# Altium schematic sheet MSP430F249.SCHDOC
size A4; Organization: UNSW Solar Racing Team; Address3: UNSW; Address4: Sydney NSW 2052; Address2: Electrical Engineering; Address1: Rm 109
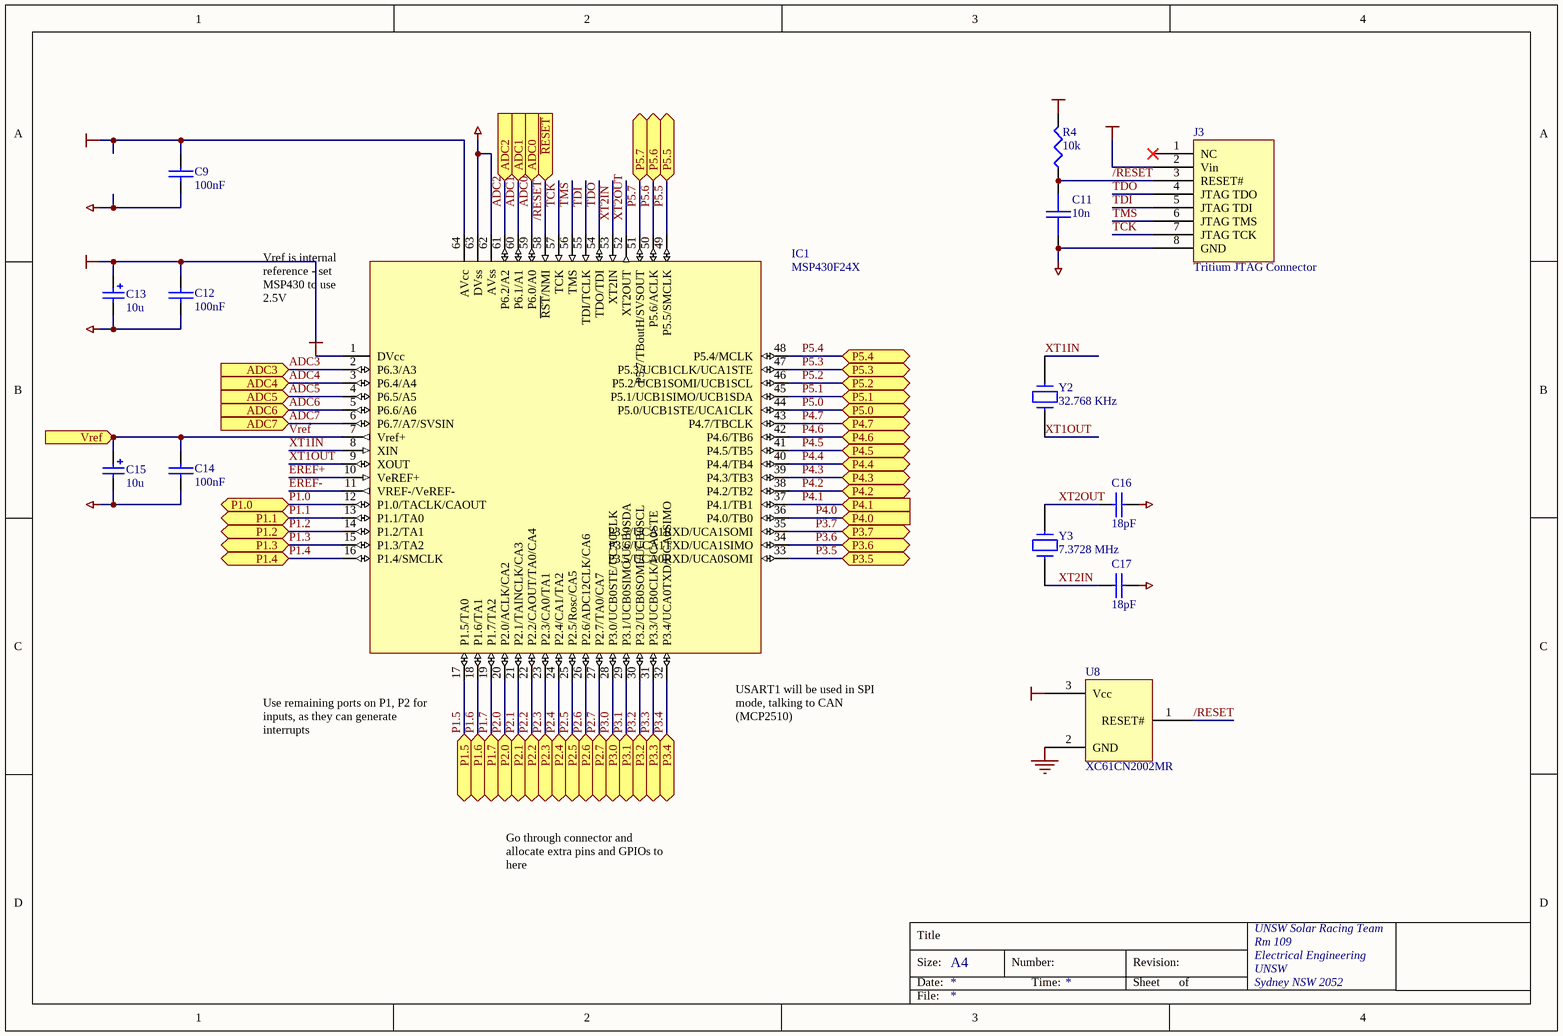
[diagram p0: MSP430F249.SCHDOC]

## Parts
C9  100nF  [0603]
C11  10n  [0603]
C12  100nF  [0603]
C13  10u  [0805]
C14  100nF  [0603]
C15  10u  [0805]
C16  18pF  [0603]
C17  18pF  [0603]
IC1  MSP430F24X  [QFP64]
J3  Tritium JTAG Connector  [IDC10]
R4  10k  [0603]
U8  XC61CN2002MR  [SOT23(3)]
Y2  32.768 KHz  [WATCHA]
Y3  7.3728 MHz  [HC49/4H]

## Ports
ADC0 (in), ADC1 (in), ADC2 (in), ADC3 (in), ADC4 (in), ADC5 (in), ADC6 (in), ADC7 (in), P1.0, P1.1, P1.2, P1.3, P1.4, P1.5, P1.6, P1.7, P2.0, P2.1, P2.2, P2.3, P2.4, P2.5, P2.6, P2.7, P3.0, P3.1, P3.2, P3.3, P3.4, P3.5, P3.6, P3.7, P4.0 (in), P4.1 (in), P4.2, P4.3, P4.4, P4.5, P4.6, P4.7, P5.0, P5.1, P5.2, P5.3, P5.4, P5.5, P5.6, P5.7, Vref (out), ~{RESET} (in)

## Nets
3V3: C9.1 C12.1 C13.1 IC1.1(DVcc) IC1.64(AVcc) J3.2(Vin) R4.2 U8.3(Vcc)
GND: C9.2 C11.2 C12.2 C13.2 C14.2 C15.2 C16.2 C17.2 IC1.62(AVss) IC1.63(DVss) J3.8(GND) U8.2(GND)
/RESET: C11.1 IC1.58(~{RST}/NMI) J3.3(RESET#) R4.1 U8.1(RESET#) ; port ~{RESET}
ADC0: IC1.59(P6.0/A0) ; port ADC0
ADC1: IC1.60(P6.1/A1) ; port ADC1
ADC2: IC1.61(P6.2/A2) ; port ADC2
ADC3: IC1.2(P6.3/A3) ; port ADC3
ADC4: IC1.3(P6.4/A4) ; port ADC4
ADC5: IC1.4(P6.5/A5) ; port ADC5
ADC6: IC1.5(P6.6/A6) ; port ADC6
ADC7: IC1.6(P6.7/A7/SVSIN) ; port ADC7
EREF+: IC1.10(VeREF+)
EREF-: IC1.11(VREF-/VeREF-)
P1.0: IC1.12(P1.0/TACLK/CAOUT) ; port P1.0
P1.1: IC1.13(P1.1/TA0) ; port P1.1
P1.2: IC1.14(P1.2/TA1) ; port P1.2
P1.3: IC1.15(P1.3/TA2) ; port P1.3
P1.4: IC1.16(P1.4/SMCLK) ; port P1.4
P1.5: IC1.17(P1.5/TA0) ; port P1.5
P1.6: IC1.18(P1.6/TA1) ; port P1.6
P1.7: IC1.19(P1.7/TA2) ; port P1.7
P2.0: IC1.20(P2.0/ACLK/CA2) ; port P2.0
P2.1: IC1.21(P2.1/TAINCLK/CA3) ; port P2.1
P2.2: IC1.22(P2.2/CAOUT/TA0/CA4) ; port P2.2
P2.3: IC1.23(P2.3/CA0/TA1) ; port P2.3
P2.4: IC1.24(P2.4/CA1/TA2) ; port P2.4
P2.5: IC1.25(P2.5/Rosc/CA5) ; port P2.5
P2.6: IC1.26(P2.6/ADC12CLK/CA6) ; port P2.6
P2.7: IC1.27(P2.7/TA0/CA7) ; port P2.7
P3.0: IC1.28(P3.0/UCB0STE/UCA0CLK) ; port P3.0
P3.1: IC1.29(P3.1/UCB0SIMO/UCB0SDA) ; port P3.1
P3.2: IC1.30(P3.2/UCB0SOMI/UCB0SCL) ; port P3.2
P3.3: IC1.31(P3.3/UCB0CLK/UCA0STE) ; port P3.3
P3.4: IC1.32(P3.4/UCA0TXD/UCA0SIMO) ; port P3.4
P3.5: IC1.33(P3.5/UCA0RXD/UCA0SOMI) ; port P3.5
P3.6: IC1.34(P3.6/UCA1TXD/UCA1SIMO) ; port P3.6
P3.7: IC1.35(P3.7/UCA1RXD/UCA1SOMI) ; port P3.7
P4.0: IC1.36(P4.0/TB0) ; port P4.0
P4.1: IC1.37(P4.1/TB1) ; port P4.1
P4.2: IC1.38(P4.2/TB2) ; port P4.2
P4.3: IC1.39(P4.3/TB3) ; port P4.3
P4.4: IC1.40(P4.4/TB4) ; port P4.4
P4.5: IC1.41(P4.5/TB5) ; port P4.5
P4.6: IC1.42(P4.6/TB6) ; port P4.6
P4.7: IC1.43(P4.7/TBCLK) ; port P4.7
P5.0: IC1.44(P5.0/UCB1STE/UCA1CLK) ; port P5.0
P5.1: IC1.45(P5.1/UCB1SIMO/UCB1SDA) ; port P5.1
P5.2: IC1.46(P5.2/UCB1SOMI/UCB1SCL) ; port P5.2
P5.3: IC1.47(P5.3/UCB1CLK/UCA1STE) ; port P5.3
P5.4: IC1.48(P5.4/MCLK) ; port P5.4
P5.5: IC1.49(P5.5/SMCLK) ; port P5.5
P5.6: IC1.50(P5.6/ACLK) ; port P5.6
P5.7: IC1.51(P5.7/TBoutH/SVSOUT) ; port P5.7
TCK: IC1.57(TCK) J3.7(JTAG_TCK)
TDI: IC1.55(TDI/TCLK) J3.5(JTAG_TDI)
TDO: IC1.54(TDO/TDI) J3.4(JTAG_TDO)
TMS: IC1.56(TMS) J3.6(JTAG_TMS)
Vref: C14.1 C15.1 IC1.7(Vref+) ; port Vref
XT1IN: IC1.8(XIN) Y2.1
XT1OUT: IC1.9(XOUT) Y2.2
XT2IN: C17.1 IC1.53(XT2IN) Y3.1
XT2OUT: C16.1 IC1.52(XT2OUT) Y3.2

Not connected (* = marked no-connect by the designer): J3 1(NC)*

## Notes on the sheet
- (near IC1) Vref is internal reference - set MSP430 to use 2.5V
- (near IC1) Use remaining ports on P1, P2 for inputs, as they can generate interrupts
- (near IC1) USART1 will be used in SPI mode, talking to CAN (MCP2510)
- Go through connector and allocate extra pins and GPIOs to here
- Title
- Size:
- Date:
- A4
- Number:
- Time:
- Revision:
- Sheet
- of
- File:

## Library data of the parts
C9 C11 C12 C14 C16 C17 = CAP: Capacitor; Supplier: Stock
C13 C15 = Cap Pol3: Polarized Capacitor (Surface Mount); Order#: 521-2820; Price: 0.489; Supplier: Farnell
J3 = 430F_JTAG_TRITIUM: Tritium JTAG interface for MSP430; Order#: 511-808; Price: 1.32; Supplier: Farnell
R4 = RES1: Resistor; Supplier: Stock
U8 = XC61F: SOT23 reset generator; Farnell: NA
Y2 Y3 = CRYSTAL
  Y2: Supplier: Stock
  Y3: Supplier: Farnell